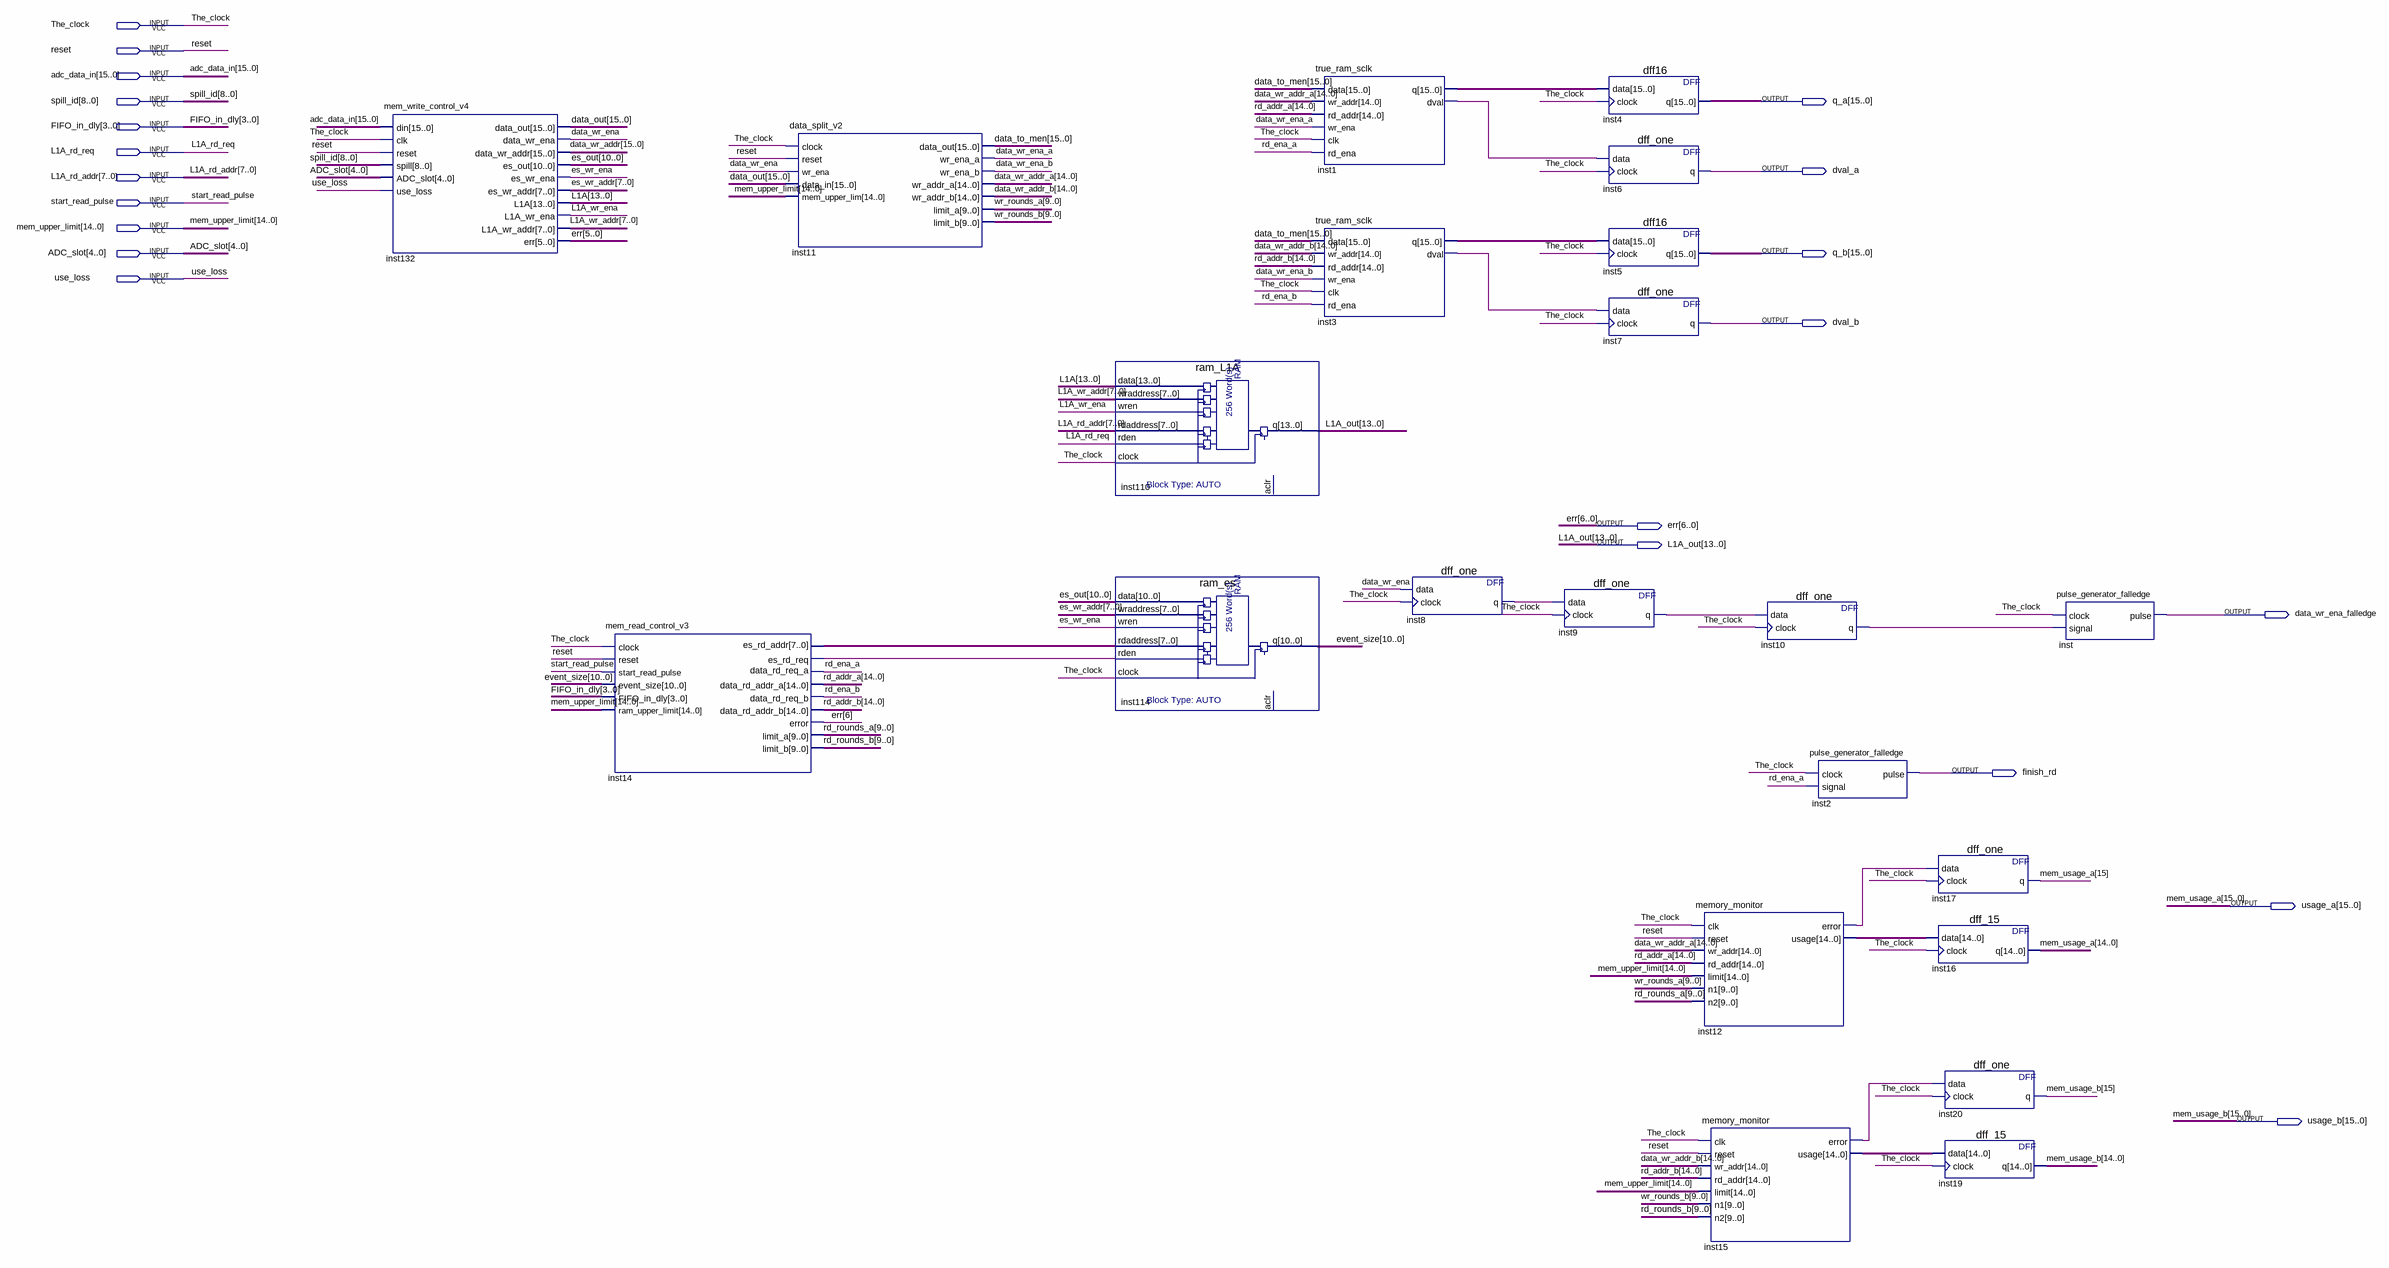
[diagram p0: schematic sheet]
// Quartus schematic ADC_manager.bdf as structural Verilog: 22 symbols, 21 pins
module ADC_manager (
  input  The_clock,
  input  reset,
  input  [15:0] adc_data_in,
  input  [8:0] spill_id,
  input  [3:0] FIFO_in_dly,
  input  L1A_rd_req,
  input  [7:0] L1A_rd_addr,
  input  start_read_pulse,
  input  [14:0] mem_upper_limit,
  input  [4:0] ADC_slot,
  input  use_loss,
  output [15:0] q_a,
  output dval_a,
  output [15:0] q_b,
  output dval_b,
  output [6:0] err,
  output [13:0] L1A_out,
  output data_wr_ena_falledge,
  output finish_rd,
  output [15:0] usage_a,
  output [15:0] usage_b
);

  wire data_wr_ena, data_wr_ena_a, data_wr_ena_b, es_wr_ena, inst1_dval, inst3_dval, inst8_q, inst9_q,
       inst10_q, inst12_error, inst14_es_rd_req, inst15_error, L1A_wr_ena, rd_ena_a, rd_ena_b;
  wire [7:0] es_wr_addr, inst14_es_rd_addr, L1A_wr_addr;
  wire [9:0] rd_rounds_a, rd_rounds_b, wr_rounds_a, wr_rounds_b;
  wire [10:0] es_out, event_size;
  wire [13:0] L1A;
  wire [14:0] data_wr_addr_a, data_wr_addr_b, inst12_usage, inst15_usage, rd_addr_a, rd_addr_b;
  wire [15:0] data_out, data_to_men, data_wr_addr, inst1_q, inst3_q;

  mem_write_control_v4 inst132 (
    .din(adc_data_in), .clk(The_clock), .reset(reset), .spill(spill_id), .ADC_slot(ADC_slot),
    .use_loss(use_loss), .data_out(data_out), .data_wr_ena(data_wr_ena), .data_wr_addr(data_wr_addr),
    .es_out(es_out), .es_wr_ena(es_wr_ena), .es_wr_addr(es_wr_addr), .L1A(L1A), .L1A_wr_ena(L1A_wr_ena),
    .L1A_wr_addr(L1A_wr_addr), .err(err[5:0]));
  mem_read_control_v3 inst14 (
    .clock(The_clock), .reset(reset), .start_read_pulse(start_read_pulse), .event_size(event_size),
    .FIFO_in_dly(FIFO_in_dly), .ram_upper_limit(mem_upper_limit), .es_rd_req(inst14_es_rd_req),
    .es_rd_addr(inst14_es_rd_addr), .data_rd_req_a(rd_ena_a), .data_rd_addr_a(rd_addr_a),
    .data_rd_req_b(rd_ena_b), .data_rd_addr_b(rd_addr_b), .error(err[6]), .limit_a(rd_rounds_a),
    .limit_b(rd_rounds_b));
  data_split_v2 inst11 (
    .clock(The_clock), .reset(reset), .wr_ena(data_wr_ena), .data_in(data_out),
    .mem_upper_lim(mem_upper_limit), .data_out(data_to_men), .wr_ena_a(data_wr_ena_a),
    .wr_ena_b(data_wr_ena_b), .wr_addr_a(data_wr_addr_a), .wr_addr_b(data_wr_addr_b), .limit_a(wr_rounds_a),
    .limit_b(wr_rounds_b));
  ram_L1A inst110 (
    .data(L1A), .wraddress(L1A_wr_addr), .wren(L1A_wr_ena), .rdaddress(L1A_rd_addr), .rden(L1A_rd_req),
    .clock(The_clock), .q(L1A_out));  // open: aclr
  ram_es inst114 (
    .data(es_out), .wraddress(es_wr_addr), .wren(es_wr_ena), .rdaddress(inst14_es_rd_addr),
    .rden(inst14_es_rd_req), .clock(The_clock), .q(event_size));  // open: aclr
  true_ram_sclk inst1 (
    .data(data_to_men), .wr_addr(data_wr_addr_a), .rd_addr(rd_addr_a), .wr_ena(data_wr_ena_a),
    .clk(The_clock), .rd_ena(rd_ena_a), .q(inst1_q), .dval(inst1_dval));
  true_ram_sclk inst3 (
    .data(data_to_men), .wr_addr(data_wr_addr_b), .rd_addr(rd_addr_b), .wr_ena(data_wr_ena_b),
    .clk(The_clock), .rd_ena(rd_ena_b), .q(inst3_q), .dval(inst3_dval));
  dff_one inst8 (.data(data_wr_ena), .clock(The_clock), .q(inst8_q));
  dff_one inst9 (.data(inst8_q), .clock(The_clock), .q(inst9_q));
  dff16 inst4 (.data(inst1_q), .clock(The_clock), .q(q_a));
  dff_one inst6 (.data(inst1_dval), .clock(The_clock), .q(dval_a));
  dff16 inst5 (.data(inst3_q), .clock(The_clock), .q(q_b));
  dff_one inst7 (.data(inst3_dval), .clock(The_clock), .q(dval_b));
  memory_monitor inst12 (
    .clk(The_clock), .reset(reset), .wr_addr(data_wr_addr_a), .rd_addr(rd_addr_a), .limit(mem_upper_limit),
    .n1(wr_rounds_a), .n2(rd_rounds_a), .error(inst12_error), .usage(inst12_usage));
  memory_monitor inst15 (
    .clk(The_clock), .reset(reset), .wr_addr(data_wr_addr_b), .rd_addr(rd_addr_b), .limit(mem_upper_limit),
    .n1(wr_rounds_b), .n2(rd_rounds_b), .error(inst15_error), .usage(inst15_usage));
  dff_one inst10 (.data(inst9_q), .clock(The_clock), .q(inst10_q));
  pulse_generator_falledge inst2 (.clock(The_clock), .signal(rd_ena_a), .pulse(finish_rd));
  dff_one inst17 (.data(inst12_error), .clock(The_clock), .q(usage_a[15]));
  dff_15 inst16 (.data(inst12_usage), .clock(The_clock), .q(usage_a[14:0]));
  dff_one inst20 (.data(inst15_error), .clock(The_clock), .q(usage_b[15]));
  dff_15 inst19 (.data(inst15_usage), .clock(The_clock), .q(usage_b[14:0]));
  pulse_generator_falledge inst (.clock(The_clock), .signal(inst10_q), .pulse(data_wr_ena_falledge));

  // Other names for the same wires on the sheet: mem_usage_a[15:0] = usage_a; mem_usage_b[15:0] = usage_b
endmodule
